# Altium project EasyPIC16F1455.PrjPcb
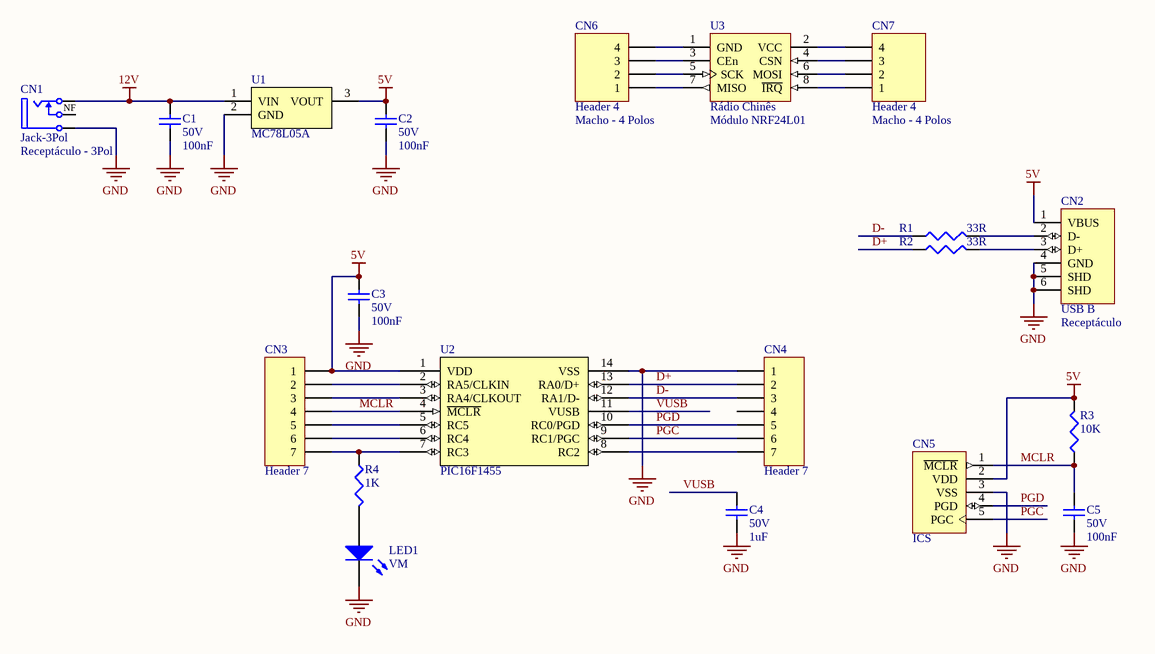
[diagram p0: EasyPIC16F1455.SchDoc]
1 sheet, 20 parts. Net scope: global (net labels, ports and power ports of the same name join across sheets).
Board files: EasyPIC16F1455.PcbDoc, EasyPIC16F1455x4.PcbDoc

## Sheet EasyPIC16F1455.SchDoc: EasyPIC16F1455
size A4; Revision: 1.0; ProjectName: EasyPIC16F1455

### Parts
C1  value 100nF  Tensão: 50V  [CC0603]  (hidden comment: Capacitor Cerâmico)
C2  value 100nF  Tensão: 50V  [CC0603]  (hidden comment: Capacitor Cerâmico)
C3  value 100nF  Tensão: 50V  [CC0603]  (hidden comment: Capacitor Cerâmico)
C4  value 1uF  Tensão: 50V  [CC0603]  (hidden comment: Capacitor Cerâmico)
C5  value 100nF  Tensão: 50V  [CC0603]  (hidden comment: Capacitor Cerâmico)
CN1  Jack-3Pol  value Receptáculo - 3Pol  [CONN_JACK-FONTE_3N]
CN2  USB B  value Receptáculo  [CONN_USB-B_RCPT-H]
CN3  Header 7  [CONN HDR1X7]
CN4  Header 7  [CONN HDR1X7]
CN5  ICS  [CONN HDR1X5]
CN6  Header 4  value Macho - 4 Polos  [CONN HDR1X4]
CN7  Header 4  value Macho - 4 Polos  [CONN HDR1X4]
LED1  value VM  [LED 0603]  (hidden comment: LED)
R1  value 33R  [CC0603]  (hidden comment: Resistor)
R2  value 33R  [CC0603]  (hidden comment: Resistor)
R3  value 10K  [CC0603]  (hidden comment: Resistor)
R4  value 1K  [CC0603]  (hidden comment: Resistor)
U1  MC78L05A  [SOT-89-3N]
U2  PIC16F1455  [SOIC-14N]
U3  Rádio Chinês  value Módulo NRF24L01  [MOD_NRF24L01]

### Nets
5V: C2.2 C3.2 CN2.1(VBUS) CN3.1 CN5.2(VDD) R3.2 U1.3(VOUT) U2.1(VDD)
12V: C1.2 CN1.1(Centro) U1.1(VIN)
GND: C1.1 C2.1 C3.1 C4.1 C5.1 CN1.2(Malha) CN2.4(GND) CN2.5(SHD) CN2.6(SHD) CN4.1 CN5.3(VSS) LED1.2(K) U1.2(GND) U2.14(VSS)
D+: CN4.2 R2.1 U2.13(RA0/D+)
D-: CN4.3 R1.1 U2.12(RA1/D-)
MCLR: C5.2 CN3.4 CN5.1(~{MCLR}) R3.1 U2.4(~{MCLR})
PGC: CN4.6 CN5.5(PGC) U2.9(RC1/PGC)
PGD: CN4.5 CN5.4(PGD) U2.10(RC0/PGD)
VUSB: C4.2 U2.11(VUSB)
NetCN2_2: CN2.2(D-) R1.2
NetCN2_3: CN2.3(D+) R2.2
NetCN3_2: CN3.2 U2.2(RA5/CLKIN)
NetCN3_3: CN3.3 U2.3(RA4/CLKOUT)
NetCN3_5: CN3.5 U2.5(RC5)
NetCN3_6: CN3.6 U2.6(RC4)
NetCN3_7: CN3.7 R4.1 U2.7(RC3)
NetCN4_7: CN4.7 U2.8(RC2)
NetCN6_1: CN6.1 U3.7(MISO)
NetCN6_2: CN6.2 U3.5(SCK)
NetCN6_3: CN6.3 U3.3(CEn)
NetCN6_4: CN6.4 U3.1(GND)
NetCN7_1: CN7.1 U3.8(~{IRQ})
NetCN7_2: CN7.2 U3.6(MOSI)
NetCN7_3: CN7.3 U3.4(CSN)
NetCN7_4: CN7.4 U3.2(VCC)
NetLED1_1: LED1.1(A) R4.2

Not connected (* = marked no-connect by the designer): CN1 3(NF); CN4 4

### Notes on the sheet
- Projeto:
- Tamanho:
- Data:
- A4
- Eng. Felipe Navarro
- Hora:
- Revisão:
- Folha
- de
- Arquivo:

### Library data of the parts
C1-C3 C5 = Cap 100nF 50V 0603 X7R: Capacitor (Semiconductor SIM Model); Chinês: Local; ChinesePrice: 0,00250; Corrente: *A; Potência: *W; Obs:: X7R; Tolerância: ±10%; Supplier 1: Digi-Key; Supplier Part Number 1: 1276-1000-1-ND; ComponentLink1Description: Datasheet; ComponentLink1URL: D:\Tecnoclade\Datasheet\!DataMissing.pdf
C4 = Cap 1uF 50V 0603 X5R: Capacitor (Semiconductor SIM Model); Chinês: Local; ChinesePrice: 0,01100; Corrente: *A; Potência: *W; Obs:: X5R; Tolerância: ±10%; Supplier 1: Digi-Key; Supplier Part Number 1: 587-2400-1-ND; ComponentLink1Description: Datasheet; ComponentLink1URL: D:\Tecnoclade\Datasheet\!DataMissing.pdf
CN1 = Jack-3Pol: Jack Socket, Thru-Hole, Vertical, 2 Conductors, 3 Contacts Single Switch, Normally Closed; ChinesePrice: 0,06600; Chinês: Local; Corrente: 2.5A; Tensão: 16VDC; Supplier 1: Digi-Key; Potência: *; Obs:: *; Tolerância: *; ComponentLink1Description: Datasheet; ComponentLink1URL: D:\Tecnoclade\Datasheet\!DataMissing.pdf; Supplier Part Number 1: CP-002A-ND
CN2 = USB B RCPT-H: Conector Jack USB B, Through Hole, Right Angle, Horizontal; ChinesePrice: 0,00000; Chinês: ----; Obs:: USB 2.0; Corrente: *; Potência: *; Supplier 1: Digi-Key; Supplier Part Number 1: A31725-ND; Tensão: *; Tolerância: *; ComponentLink1Description: Datasheet; ComponentLink1URL: D:\Tecnoclade\Datasheet\!DataMissing.pdf
CN3 CN4 = Header 7: Header, 7-Pin; ChinesePrice: 0,10000; Chinês: Proved - Local; Value: Barra de 40 pinos - ATENÇÃO; Corrente: *; Potência: *; Supplier 1: Digi-Key; Supplier Part Number 1: A26509-40-ND; Tensão: *; Obs:: *; Tolerância: *; ComponentLink1Description: Datasheet; ComponentLink1URL: D:\Tecnoclade\Datasheet\!DataMissing.pdf
CN5 = Header 5 ICS: Header, 5-Pin; ChinesePrice: 0,10000; Chinês: Proved - Local; Value: Barra de 40 pinos - ATENÇÃO; Corrente: *; Potência: *; Supplier 1: Digi-Key; Supplier Part Number 1: A26509-40-ND; Tensão: *; Obs:: *; Tolerância: *; ComponentLink1Description: Datasheet; ComponentLink1URL: D:\Tecnoclade\Datasheet\!DataMissing.pdf
CN6 CN7 = Header 4: Header, 4-Pin; ChinesePrice: 0,10000; Chinês: Proved - Local; Obs:: Barra de 40 pinos - ATENÇÃO; Corrente: *; Potência: *; Supplier 1: Digi-Key; Supplier Part Number 1: A26509-40-ND; Tensão: *; Tolerância: *; ComponentLink1Description: Datasheet; ComponentLink1URL: D:\Tecnoclade\Datasheet\!DataMissing.pdf
LED1 = LED: ChinesePrice: 0,00000; Chinês: ----; Corrente: *; Potência: *; Supplier 1: Digi-Key; Supplier Part Number 1: 160-1479-1-ND; Tensão: *; Obs:: *; Tolerância: *; ComponentLink1Description: Datasheet; ComponentLink1URL: D:\Tecnoclade\Datasheet\!DataMissing.pdf
R1 R2 = Res 33R 1% 0603 1/10W: ChinesePrice: 0,00000; Chinês: ----; Corrente: *A; Potência: 1/10W; Tensão: *V; Obs: ±100ppm/ºC; Tolerância: ±1%; Supplier 1: Digi-Key; Supplier Part Number 1: P33.0HCT-ND; ComponentLink1Description: Datasheet; ComponentLink1URL: D:\Tecnoclade\Datasheet\!DataMissing.pdf
R3 = Res 10K 1% 0603 1/10W: ChinesePrice: 0,00089; Chinês: Local; Corrente: *A; Potência: 1/10W; Tensão: *V; Tolerância: ±1%; Supplier 1: Digi-Key; Supplier Part Number 1: P10.0KHCT-ND; Obs: *; ComponentLink1Description: Datasheet; ComponentLink1URL: D:\Tecnoclade\Datasheet\!DataMissing.pdf
R4 = Res 1K 1% 0603 1/10W: ChinesePrice: 0,00089; Chinês: Local; Corrente: *A; Potência: 1/10W; Tensão: *V; Tolerância: ±1%; Supplier 1: Digi-Key; Supplier Part Number 1: RMCF0603FT1K00CT-ND; Obs: *; ComponentLink1Description: Datasheet; ComponentLink1URL: D:\Tecnoclade\Datasheet\!DataMissing.pdf
U1 = MC78L05: Regulador Linear 5V; Chinês: -----; Corrente: 100mA; ChinesePrice: 0,00000; Potência: *; Value: *; Supplier 1: Digi-Key; Supplier Part Number 1: MC78L05ACHXCT-ND; Tensão: 5V; Obs:: *; Tolerância: *; ComponentLink1Description: Datasheet; ComponentLink1URL: D:\Tecnoclade\Datasheet\
U2 = PIC16F1455: Microcontrolador PIC; ChinesePrice: 0,00000; Chinês: ----; Tensão: 2V3 ~ 5V5; Value: 8 Bits; Obs:: 48MHz; Corrente: *; Potência: *; Supplier 1: Digi-Key; Supplier Part Number 1: PIC16F1455-I/SL-ND; Tolerância: *; ComponentLink1Description: Datasheet; ComponentLink1URL: D:\Tecnoclade\Datasheet\PIC16F1455.pdf
U3 = Modulo RF NRF24L01: Módulo de rádio com nRF24L01; ChinesePrice: 0,00000; Chinês: 4008-555-368; Corrente: *; Potência: *; Supplier 1: Digi-Key; Supplier Part Number 1: --Radio; Tensão: *; Obs:: *; Tolerância: *; ComponentLink1Description: Datasheet; ComponentLink1URL: D:\Tecnoclade\Datasheet\Modulo RF Chinês NRF24L01.pdf